# EAGLE schematic rwr_schematic (EAGLE 7.4.0)

## Sheet 1 of 8: Microcontroller Circuitry
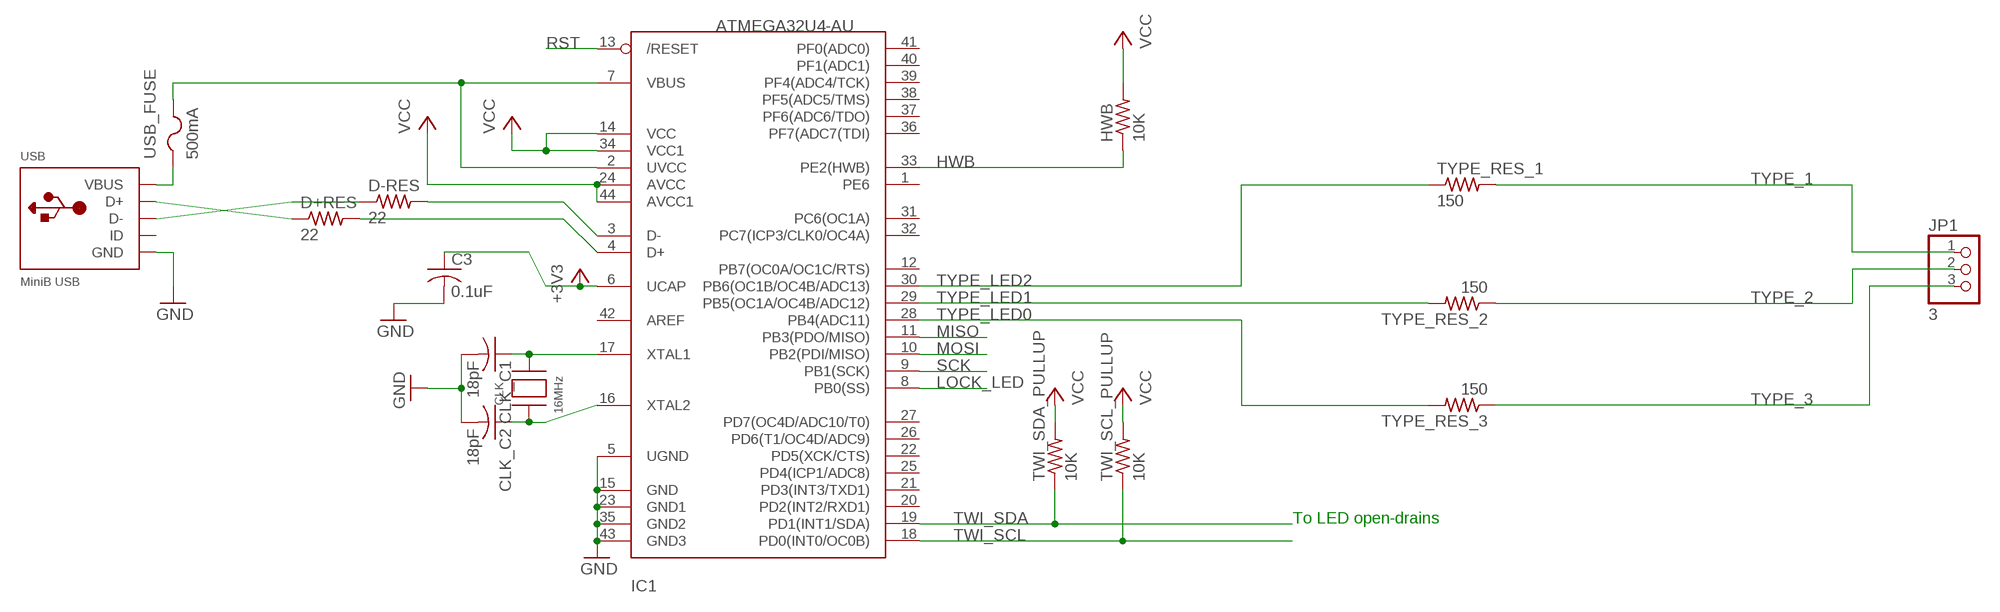
[diagram p0: schematic, sheet 1]

### Parts
C3  0.1uF  C-USC0805K  [C0805K]
CLK  16MHz  XTALNX5032  [NX5032]
CLK_C1  18pF  C-USC0805K  [C0805K]
CLK_C2  18pF  C-USC0805K  [C0805K]
D+RES  22  R-US_R0805  [R0805]
D-RES  22  R-US_R0805  [R0805]
HWB  10K  R-US_R0805  [R0805]
IC1  ATMEGA32U4-AU  [TQFP44]
JP1  3  PINHD-1X3  [1X03]
TWI_SCL_PULLUP  10K  R-US_R0805  [R0805]
TWI_SDA_PULLUP  10K  R-US_R0805  [R0805]
TYPE_RES_1  150  R-US_R0805  [R0805]
TYPE_RES_2  150  R-US_R0805  [R0805]
TYPE_RES_3  150  R-US_R0805  [R0805]
USB  MiniB USB  USBMINIB  [USB-MINIB]
USB_FUSE  500mA  PTCFUSE-1206  [R1206]

### Nets
+3V3: C3.1 IC1.6(UCAP)
GND: C3.2 CLK_C1.2 CLK_C2.2 IC1.5(UGND) IC1.15(GND) IC1.23(GND1) IC1.35(GND2) IC1.43(GND3) USB.GND ; also sheet 2,3,4,5,6,7,8
HWB: HWB.1 IC1.33(PE2(HWB))
LOCK_LED: IC1.8(PB0(SS)) ; also sheet 8
MISO: IC1.11(PB3(PDO/MISO)) ; also sheet 3
MOSI: IC1.10(PB2(PDI/MISO)) ; also sheet 3
N$10: IC1.2(UVCC) IC1.7(VBUS) USB_FUSE.2
N$61: D-RES.2 IC1.3(D-)
N$62: D+RES.2 IC1.4(D+)
N$63: CLK.P$1 CLK_C2.1 IC1.16(XTAL2)
N$64: CLK.P$2 CLK_C1.1 IC1.17(XTAL1)
N$67: D+RES.1 USB.D+
N$68: D-RES.1 USB.D-
RST: IC1.13(/RESET) ; also sheet 3
SCK: IC1.9(PB1(SCK)) ; also sheet 3
TWI_SCL: IC1.18(PD0(INT0/OC0B)) TWI_SCL_PULLUP.1 ; also sheet 4,5,6,7
TWI_SDA: IC1.19(PD1(INT1/SDA)) TWI_SDA_PULLUP.1 ; also sheet 4,5,6,7
TYPE_1: JP1.1 TYPE_RES_1.2
TYPE_2: JP1.2 TYPE_RES_2.1
TYPE_3: JP1.3 TYPE_RES_3.1
TYPE_LED0: IC1.28(PB4(ADC11)) TYPE_RES_3.2
TYPE_LED1: IC1.29(PB5(OC1A/OC4B/ADC12)) TYPE_RES_2.2
TYPE_LED2: IC1.30(PB6(OC1B/OC4B/ADC13)) TYPE_RES_1.1
VBUS: USB.VBUS USB_FUSE.1
VCC [Power]: HWB.2 IC1.14(VCC) IC1.24(AVCC) IC1.34(VCC1) IC1.44(AVCC1) TWI_SCL_PULLUP.2 TWI_SDA_PULLUP.2 ; also sheet 2,3,4,5,6,7,8
Unconnected: IC1.1(PE6) IC1.12(PB7(OC0A/OC1C/RTS)) IC1.20(PD2(INT2/RXD1)) IC1.21(PD3(INT3/TXD1)) IC1.22(PD5(XCK/CTS)) IC1.25(PD4(ICP1/ADC8)) IC1.26(PD6(T1/OC4D/ADC9)) IC1.27(PD7(OC4D/ADC10/T0)) IC1.31(PC6(OC1A)) IC1.32(PC7(ICP3/CLK0/OC4A)) IC1.36(PF7(ADC7(TDI)) IC1.37(PF6(ADC6/TDO)) IC1.38(PF5(ADC5/TMS)) IC1.39(PF4(ADC4/TCK)) IC1.40(PF1(ADC1)) IC1.41(PF0(ADC0)) IC1.42(AREF) USB.ID

### Notes on the sheet
- To LED open-drains

## Sheet 2 of 8: Power Circuitry
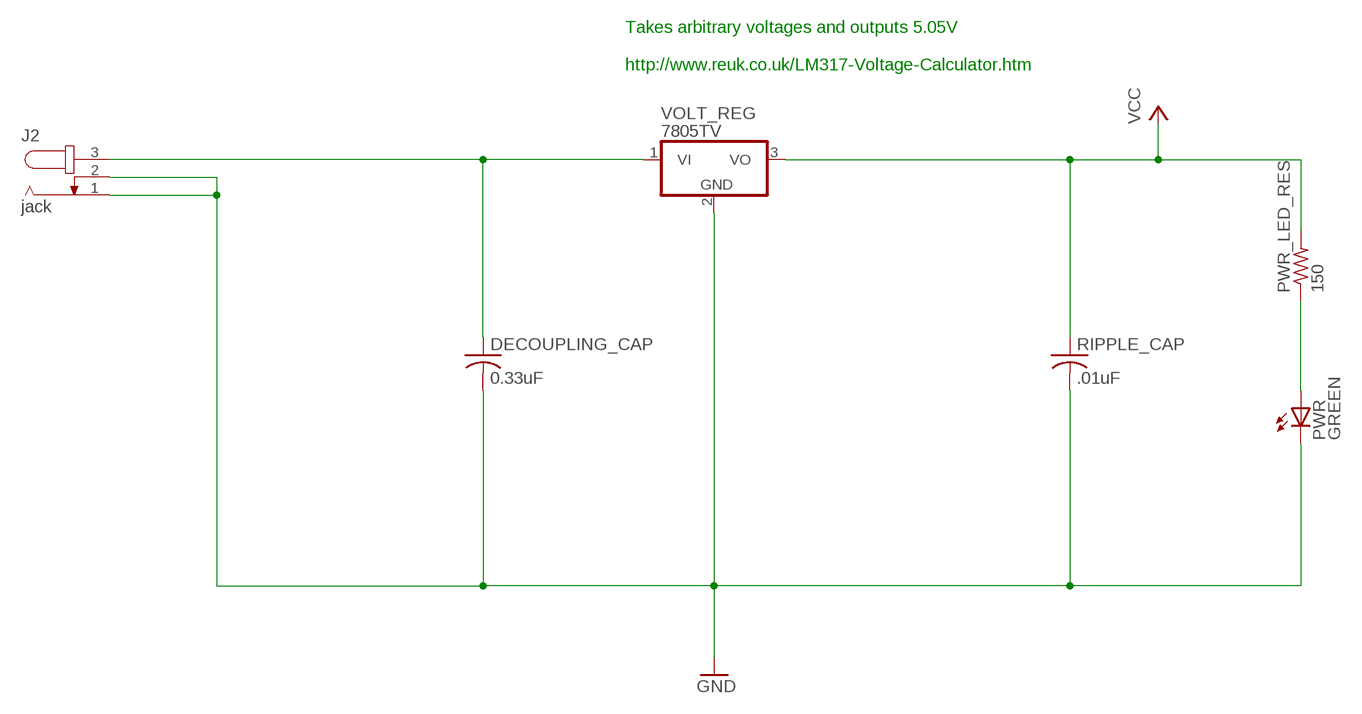
[diagram p1: schematic, sheet 2]

### Parts
DECOUPLING_CAP  0.33uF  C-USC0805K  [C0805K]
J2  jack  JACK-PLUG0  [SPC4077]
PWR  GREEN  LEDCHIPLED_0805  [CHIPLED_0805]
PWR_LED_RES  150  R-US_R0805  [R0805]
RIPPLE_CAP  .01uF  C-USC0805K  [C0805K]
VOLT_REG  7805TV  [TO220V]

### Nets
GND: DECOUPLING_CAP.2 J2.1 J2.2 PWR.C RIPPLE_CAP.2 VOLT_REG.2(GND) ; also sheet 1,3,4,5,6,7,8
JACK_VCC [big_power]: DECOUPLING_CAP.1 J2.3 VOLT_REG.1(VI)
N$44: PWR.A PWR_LED_RES.1
VCC [Power]: PWR_LED_RES.2 RIPPLE_CAP.1 VOLT_REG.3(VO) ; also sheet 1,3,4,5,6,7,8

### Notes on the sheet
- Takes arbitrary voltages and outputs 5.05V
  
  http://www.reuk.co.uk/LM317-Voltage-Calculator.htm

## Sheet 3 of 8: ISP Programmer
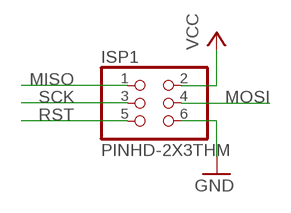
[diagram p2: schematic, sheet 3]

### Parts
ISP1  PINHD-2X3THM  [ISP6]

### Nets
GND: ISP1.6 ; also sheet 1,2,4,5,6,7,8
MISO: ISP1.1 ; also sheet 1
MOSI: ISP1.4 ; also sheet 1
RST: ISP1.5 ; also sheet 1
SCK: ISP1.3 ; also sheet 1
VCC [Power]: ISP1.2 ; also sheet 1,2,4,5,6,7,8

## Sheet 4 of 8: Signal Strength LEDs
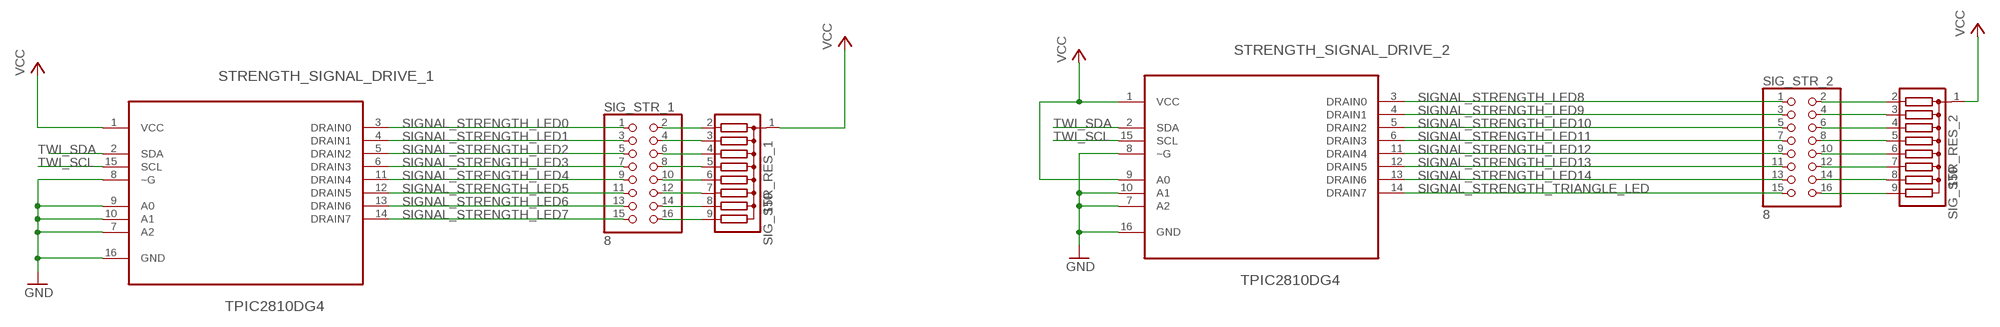
[diagram p3: schematic, sheet 4]

### Parts
SIG_STR_1  8  PINHD-2X8  [2X08]
SIG_STR_2  8  PINHD-2X8  [2X08]
SIG_STR_RES_1  150  G08R  [SIL9]
SIG_STR_RES_2  150  G08R  [SIL9]
STRENGTH_SIGNAL_DRIVE_1  TPIC2810DG4  [SOIC127P600X175-16N]
STRENGTH_SIGNAL_DRIVE_2  TPIC2810DG4  [SOIC127P600X175-16N]

### Nets
GND: STRENGTH_SIGNAL_DRIVE_1.7(A2) STRENGTH_SIGNAL_DRIVE_1.8(~G) STRENGTH_SIGNAL_DRIVE_1.9(A0) STRENGTH_SIGNAL_DRIVE_1.10(A1) STRENGTH_SIGNAL_DRIVE_1.16(GND) STRENGTH_SIGNAL_DRIVE_2.7(A2) STRENGTH_SIGNAL_DRIVE_2.8(~G) STRENGTH_SIGNAL_DRIVE_2.10(A1) STRENGTH_SIGNAL_DRIVE_2.16(GND) ; also sheet 1,2,3,5,6,7,8
N$1: SIG_STR_2.16 SIG_STR_RES_2.9
N$2: SIG_STR_2.14 SIG_STR_RES_2.8
N$3: SIG_STR_2.12 SIG_STR_RES_2.7
N$4: SIG_STR_2.10 SIG_STR_RES_2.6
N$5: SIG_STR_2.8 SIG_STR_RES_2.5
N$6: SIG_STR_2.6 SIG_STR_RES_2.4
N$7: SIG_STR_2.4 SIG_STR_RES_2.3
N$8: SIG_STR_2.2 SIG_STR_RES_2.2
N$9: SIG_STR_1.16 SIG_STR_RES_1.9
N$11: SIG_STR_1.14 SIG_STR_RES_1.8
N$12: SIG_STR_1.12 SIG_STR_RES_1.7
N$18: SIG_STR_1.10 SIG_STR_RES_1.6
N$20: SIG_STR_1.8 SIG_STR_RES_1.5
N$22: SIG_STR_1.6 SIG_STR_RES_1.4
N$23: SIG_STR_1.4 SIG_STR_RES_1.3
N$24: SIG_STR_1.2 SIG_STR_RES_1.2
SIGNAL_STRENGTH_LED0: SIG_STR_1.1 STRENGTH_SIGNAL_DRIVE_1.3(DRAIN0)
SIGNAL_STRENGTH_LED1: SIG_STR_1.3 STRENGTH_SIGNAL_DRIVE_1.4(DRAIN1)
SIGNAL_STRENGTH_LED2: SIG_STR_1.5 STRENGTH_SIGNAL_DRIVE_1.5(DRAIN2)
SIGNAL_STRENGTH_LED3: SIG_STR_1.7 STRENGTH_SIGNAL_DRIVE_1.6(DRAIN3)
SIGNAL_STRENGTH_LED4: SIG_STR_1.9 STRENGTH_SIGNAL_DRIVE_1.11(DRAIN4)
SIGNAL_STRENGTH_LED5: SIG_STR_1.11 STRENGTH_SIGNAL_DRIVE_1.12(DRAIN5)
SIGNAL_STRENGTH_LED6: SIG_STR_1.13 STRENGTH_SIGNAL_DRIVE_1.13(DRAIN6)
SIGNAL_STRENGTH_LED7: SIG_STR_1.15 STRENGTH_SIGNAL_DRIVE_1.14(DRAIN7)
SIGNAL_STRENGTH_LED8: SIG_STR_2.1 STRENGTH_SIGNAL_DRIVE_2.3(DRAIN0)
SIGNAL_STRENGTH_LED9: SIG_STR_2.3 STRENGTH_SIGNAL_DRIVE_2.4(DRAIN1)
SIGNAL_STRENGTH_LED10: SIG_STR_2.5 STRENGTH_SIGNAL_DRIVE_2.5(DRAIN2)
SIGNAL_STRENGTH_LED11: SIG_STR_2.7 STRENGTH_SIGNAL_DRIVE_2.6(DRAIN3)
SIGNAL_STRENGTH_LED12: SIG_STR_2.9 STRENGTH_SIGNAL_DRIVE_2.11(DRAIN4)
SIGNAL_STRENGTH_LED13: SIG_STR_2.11 STRENGTH_SIGNAL_DRIVE_2.12(DRAIN5)
SIGNAL_STRENGTH_LED14: SIG_STR_2.13 STRENGTH_SIGNAL_DRIVE_2.13(DRAIN6)
SIGNAL_STRENGTH_TRIANGLE_LED: SIG_STR_2.15 STRENGTH_SIGNAL_DRIVE_2.14(DRAIN7)
TWI_SCL: STRENGTH_SIGNAL_DRIVE_1.15(SCL) STRENGTH_SIGNAL_DRIVE_2.15(SCL) ; also sheet 1,5,6,7
TWI_SDA: STRENGTH_SIGNAL_DRIVE_1.2(SDA) STRENGTH_SIGNAL_DRIVE_2.2(SDA) ; also sheet 1,5,6,7
VCC [Power]: SIG_STR_RES_1.1 SIG_STR_RES_2.1 STRENGTH_SIGNAL_DRIVE_1.1(VCC) STRENGTH_SIGNAL_DRIVE_2.1(VCC) STRENGTH_SIGNAL_DRIVE_2.9(A0) ; also sheet 1,2,3,5,6,7,8

## Sheet 5 of 8: Main target directional LEDs
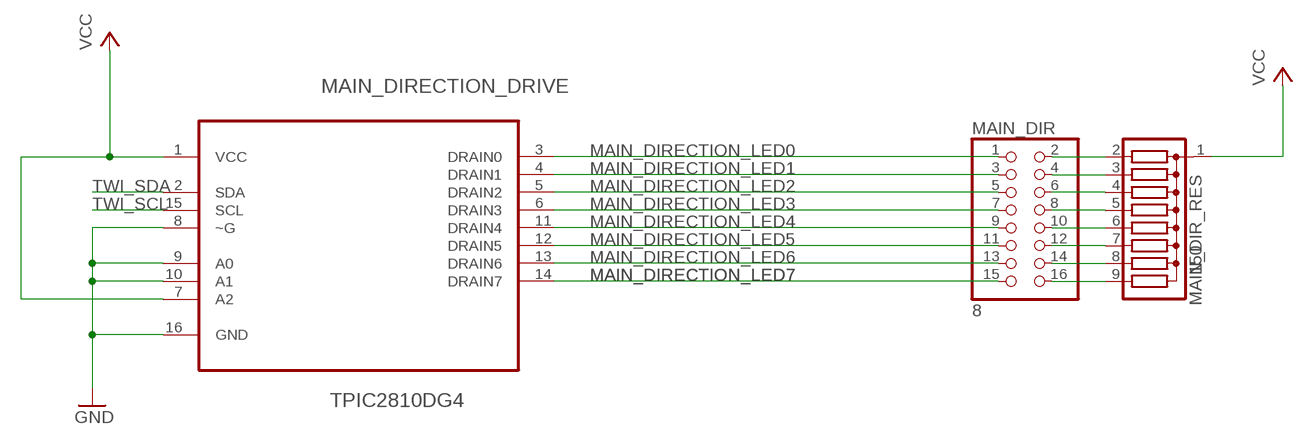
[diagram p4: schematic, sheet 5]

### Parts
MAIN_DIR  8  PINHD-2X8  [2X08]
MAIN_DIR_RES  150  G08R  [SIL9]
MAIN_DIRECTION_DRIVE  TPIC2810DG4  [SOIC127P600X175-16N]

### Nets
GND: MAIN_DIRECTION_DRIVE.8(~G) MAIN_DIRECTION_DRIVE.9(A0) MAIN_DIRECTION_DRIVE.10(A1) MAIN_DIRECTION_DRIVE.16(GND) ; also sheet 1,2,3,4,6,7,8
MAIN_DIRECTION_LED0: MAIN_DIR.1 MAIN_DIRECTION_DRIVE.3(DRAIN0)
MAIN_DIRECTION_LED1: MAIN_DIR.3 MAIN_DIRECTION_DRIVE.4(DRAIN1)
MAIN_DIRECTION_LED2: MAIN_DIR.5 MAIN_DIRECTION_DRIVE.5(DRAIN2)
MAIN_DIRECTION_LED3: MAIN_DIR.7 MAIN_DIRECTION_DRIVE.6(DRAIN3)
MAIN_DIRECTION_LED4: MAIN_DIR.9 MAIN_DIRECTION_DRIVE.11(DRAIN4)
MAIN_DIRECTION_LED5: MAIN_DIR.11 MAIN_DIRECTION_DRIVE.12(DRAIN5)
MAIN_DIRECTION_LED6: MAIN_DIR.13 MAIN_DIRECTION_DRIVE.13(DRAIN6)
MAIN_DIRECTION_LED7: MAIN_DIR.15 MAIN_DIRECTION_DRIVE.14(DRAIN7)
N$14: MAIN_DIR.2 MAIN_DIR_RES.2
N$26: MAIN_DIR.16 MAIN_DIR_RES.9
N$28: MAIN_DIR.14 MAIN_DIR_RES.8
N$29: MAIN_DIR.12 MAIN_DIR_RES.7
N$30: MAIN_DIR.10 MAIN_DIR_RES.6
N$31: MAIN_DIR.8 MAIN_DIR_RES.5
N$32: MAIN_DIR.4 MAIN_DIR_RES.3
N$33: MAIN_DIR.6 MAIN_DIR_RES.4
TWI_SCL: MAIN_DIRECTION_DRIVE.15(SCL) ; also sheet 1,4,6,7
TWI_SDA: MAIN_DIRECTION_DRIVE.2(SDA) ; also sheet 1,4,6,7
VCC [Power]: MAIN_DIR_RES.1 MAIN_DIRECTION_DRIVE.1(VCC) MAIN_DIRECTION_DRIVE.7(A2) ; also sheet 1,2,3,4,6,7,8

## Sheet 6 of 8: Other target directional LEDs
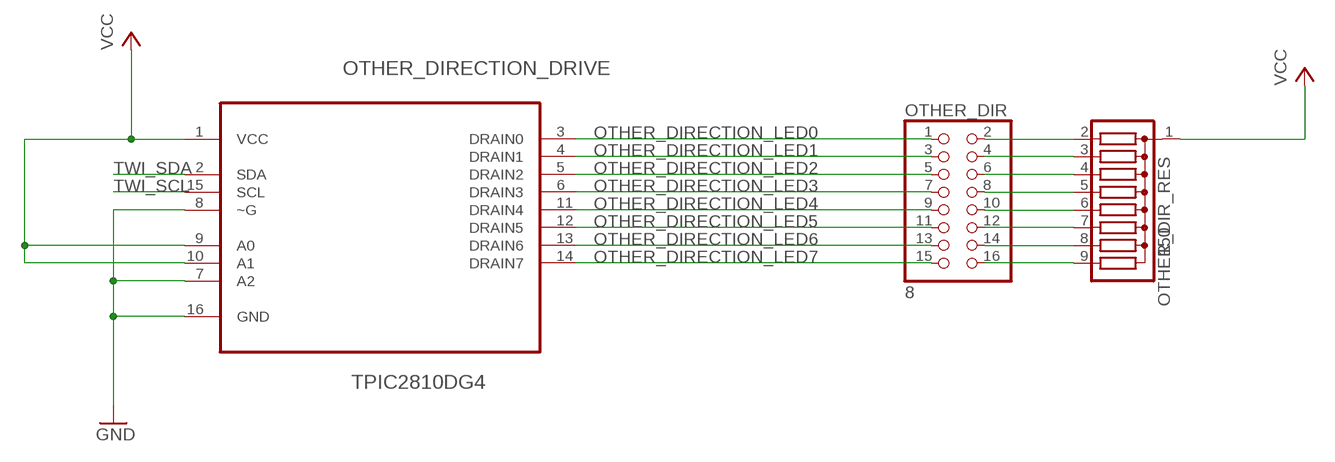
[diagram p5: schematic, sheet 6]

### Parts
OTHER_DIR  8  PINHD-2X8  [2X08]
OTHER_DIR_RES  150  G08R  [SIL9]
OTHER_DIRECTION_DRIVE  TPIC2810DG4  [SOIC127P600X175-16N]

### Nets
GND: OTHER_DIRECTION_DRIVE.7(A2) OTHER_DIRECTION_DRIVE.8(~G) OTHER_DIRECTION_DRIVE.16(GND) ; also sheet 1,2,3,4,5,7,8
N$13: OTHER_DIR.2 OTHER_DIR_RES.2
N$34: OTHER_DIR.4 OTHER_DIR_RES.3
N$35: OTHER_DIR.8 OTHER_DIR_RES.5
N$36: OTHER_DIR.6 OTHER_DIR_RES.4
N$37: OTHER_DIR.10 OTHER_DIR_RES.6
N$38: OTHER_DIR.12 OTHER_DIR_RES.7
N$39: OTHER_DIR.14 OTHER_DIR_RES.8
N$40: OTHER_DIR.16 OTHER_DIR_RES.9
OTHER_DIRECTION_LED0: OTHER_DIR.1 OTHER_DIRECTION_DRIVE.3(DRAIN0)
OTHER_DIRECTION_LED1: OTHER_DIR.3 OTHER_DIRECTION_DRIVE.4(DRAIN1)
OTHER_DIRECTION_LED2: OTHER_DIR.5 OTHER_DIRECTION_DRIVE.5(DRAIN2)
OTHER_DIRECTION_LED3: OTHER_DIR.7 OTHER_DIRECTION_DRIVE.6(DRAIN3)
OTHER_DIRECTION_LED4: OTHER_DIR.9 OTHER_DIRECTION_DRIVE.11(DRAIN4)
OTHER_DIRECTION_LED5: OTHER_DIR.11 OTHER_DIRECTION_DRIVE.12(DRAIN5)
OTHER_DIRECTION_LED6: OTHER_DIR.13 OTHER_DIRECTION_DRIVE.13(DRAIN6)
OTHER_DIRECTION_LED7: OTHER_DIR.15 OTHER_DIRECTION_DRIVE.14(DRAIN7)
TWI_SCL: OTHER_DIRECTION_DRIVE.15(SCL) ; also sheet 1,4,5,7
TWI_SDA: OTHER_DIRECTION_DRIVE.2(SDA) ; also sheet 1,4,5,7
VCC [Power]: OTHER_DIR_RES.1 OTHER_DIRECTION_DRIVE.1(VCC) OTHER_DIRECTION_DRIVE.9(A0) OTHER_DIRECTION_DRIVE.10(A1) ; also sheet 1,2,3,4,5,7,8

## Sheet 7 of 8: Misc LEDs
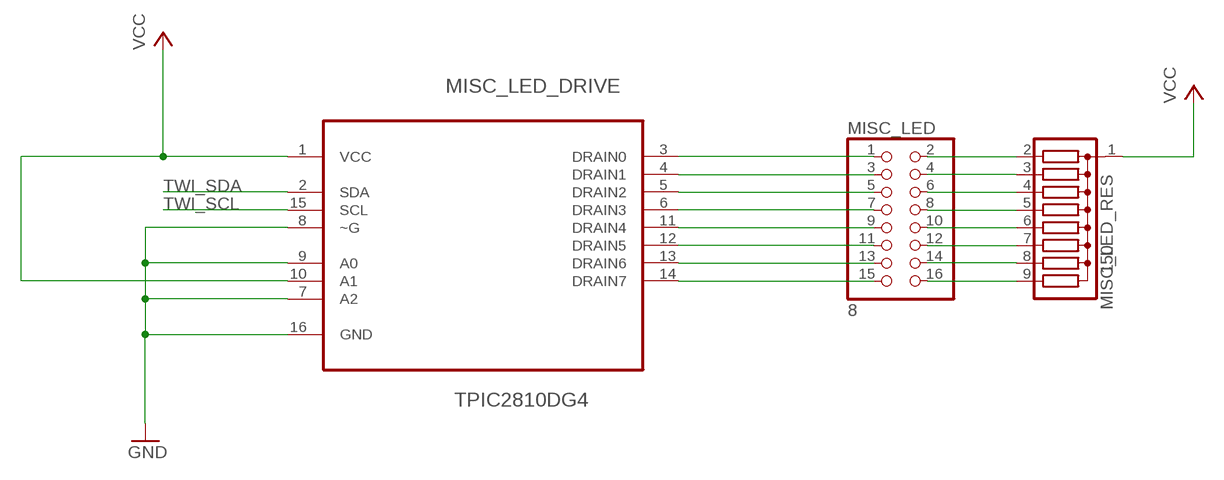
[diagram p6: schematic, sheet 7]

### Parts
MISC_LED  8  PINHD-2X8  [2X08]
MISC_LED_DRIVE  TPIC2810DG4  [SOIC127P600X175-16N]
MISC_LED_RES  150  G08R  [SIL9]

### Nets
GND: MISC_LED_DRIVE.7(A2) MISC_LED_DRIVE.8(~G) MISC_LED_DRIVE.9(A0) MISC_LED_DRIVE.16(GND) ; also sheet 1,2,3,4,5,6,8
N$16: MISC_LED.15 MISC_LED_DRIVE.14(DRAIN7)
N$17: MISC_LED.13 MISC_LED_DRIVE.13(DRAIN6)
N$19: MISC_LED.11 MISC_LED_DRIVE.12(DRAIN5)
N$21: MISC_LED.9 MISC_LED_DRIVE.11(DRAIN4)
N$25: MISC_LED.7 MISC_LED_DRIVE.6(DRAIN3)
N$41: MISC_LED.2 MISC_LED_RES.2
N$42: MISC_LED.4 MISC_LED_RES.3
N$43: MISC_LED.6 MISC_LED_RES.4
N$45: MISC_LED.8 MISC_LED_RES.5
N$47: MISC_LED.10 MISC_LED_RES.6
N$48: MISC_LED.12 MISC_LED_RES.7
N$49: MISC_LED.14 MISC_LED_RES.8
N$50: MISC_LED.16 MISC_LED_RES.9
N$51: MISC_LED.5 MISC_LED_DRIVE.5(DRAIN2)
N$52: MISC_LED.3 MISC_LED_DRIVE.4(DRAIN1)
N$53: MISC_LED.1 MISC_LED_DRIVE.3(DRAIN0)
TWI_SCL: MISC_LED_DRIVE.15(SCL) ; also sheet 1,4,5,6
TWI_SDA: MISC_LED_DRIVE.2(SDA) ; also sheet 1,4,5,6
VCC [Power]: MISC_LED_DRIVE.1(VCC) MISC_LED_DRIVE.10(A1) MISC_LED_RES.1 ; also sheet 1,2,3,4,5,6,8

## Sheet 8 of 8: Lock LEDs
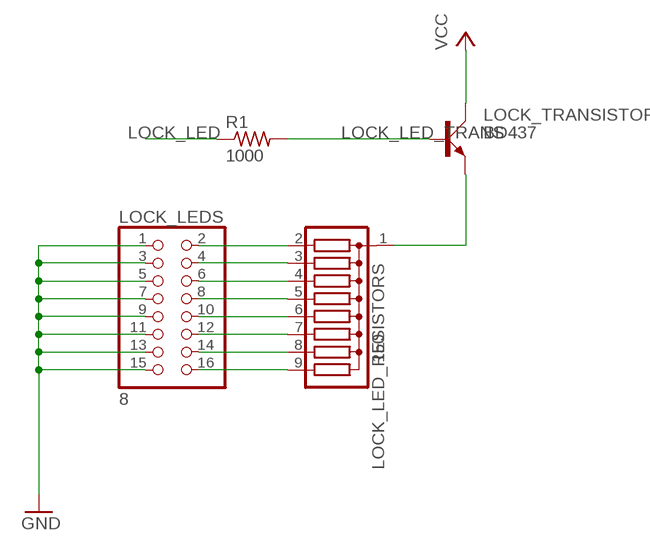
[diagram p7: schematic, sheet 8]

### Parts
LOCK_LED_RESISTORS  150  G08R  [SIL9]
LOCK_LEDS  8  PINHD-2X8  [2X08]
LOCK_TRANSISTOR  BD437  [TO126AV]
R1  1000  R-US_R0805  [R0805]

### Nets
GND: LOCK_LEDS.1 LOCK_LEDS.3 LOCK_LEDS.5 LOCK_LEDS.7 LOCK_LEDS.9 LOCK_LEDS.11 LOCK_LEDS.13 LOCK_LEDS.15 ; also sheet 1,2,3,4,5,6,7
LOCK_LED: R1.1 ; also sheet 1
LOCK_LED_TRANS: LOCK_TRANSISTOR.B R1.2
LOCK_TRANSISTOR: LOCK_LED_RESISTORS.1 LOCK_TRANSISTOR.E
N$15: LOCK_LED_RESISTORS.2 LOCK_LEDS.2
N$27: LOCK_LED_RESISTORS.3 LOCK_LEDS.4
N$46: LOCK_LED_RESISTORS.4 LOCK_LEDS.6
N$54: LOCK_LED_RESISTORS.5 LOCK_LEDS.8
N$55: LOCK_LED_RESISTORS.6 LOCK_LEDS.10
N$56: LOCK_LED_RESISTORS.7 LOCK_LEDS.12
N$57: LOCK_LED_RESISTORS.8 LOCK_LEDS.14
N$58: LOCK_LED_RESISTORS.9 LOCK_LEDS.16
VCC [Power]: LOCK_TRANSISTOR.C ; also sheet 1,2,3,4,5,6,7

## Library data of the parts
C3 CLK_C1 CLK_C2 DECOUPLING_CAP RIPPLE_CAP = adafruit:C-US: CAPACITOR, American symbol
CLK = adaprog:XTAL
D+RES D-RES HWB PWR_LED_RES TWI_SCL_PULLUP TWI_SDA_PULLUP = adafruit:R-US_: RESISTOR, American symbol
IC1 = adaprog:ATMEGA32U4
ISP1 = adaprog:PINHD-2X3
J2 = con-jack:JACK-PLUG: DC POWER JACK Power Jack, DC, Right Angle, Through Hole, Rated 5A at 16VDC, PC Terminals Distributor: Farnell (www.Farnell.de) Drawing: 84N1161.pdf / 84N1162.pdf Manufacturer: SPC Technology (www.spctechnology.com) Type: SPC4077 / SPC 4078; OC_FARNELL: unknown; OC_NEWARK: unknown
JP1 = pinhead:PINHD-1X3: PIN HEADER
LOCK_LED_RESISTORS MAIN_DIR_RES MISC_LED_RES OTHER_DIR_RES SIG_STR_RES_1 SIG_STR_RES_2 = resistor-sil:G08R: SIL RESISTOR; OC_FARNELL: unknown; OC_NEWARK: unknown
LOCK_LEDS MAIN_DIR MISC_LED OTHER_DIR SIG_STR_1 SIG_STR_2 = pinhead:PINHD-2X8: PIN HEADER
LOCK_TRANSISTOR = transistor-power:BD437: NPN TRANSISTOR
MAIN_DIRECTION_DRIVE MISC_LED_DRIVE OTHER_DIRECTION_DRIVE STRENGTH_SIGNAL_DRIVE_1 STRENGTH_SIGNAL_DRIVE_2 = ti_led_driver:TPIC2810DG4: 8-BIT LED DRIVER WITH I2C INTERFACE; MPN: TPIC2810DG4; OC_FARNELL: -; OC_NEWARK: 02M4281; PACKAGE: SOIC-16; SUPPLIER: TEXAS INSTRUMENTS
PWR = adafruit:LED: LED OSRAM: - CHIPLED LG R971, LG N971, LY N971, LG Q971, LY Q971, LO R971, LY R971 LH N974, LH R974 LS Q976, LO Q976, LY Q976 LO Q996 - Hyper CHIPLED LW Q18S LB Q993, LB Q99A, LB R99A - SideLED LS A670, LO A670, LY A670, LG A670, LP A670 LB A673, LV A673, LT A673, LW A673 LH A674 LY A675 LS A676, LA A676, LO A676, LY A676, LW A676 LS A679, LY A679, LG A679 - Hyper Micro SIDELED® LS Y876, LA Y876, LO Y876, LY Y876 LT Y87S - SmartLED LW L88C, LW L88S LB L89C, LB L89S, LG L890 LS L89K, LO L89K, LY L89K LS L896, LA L896, LO L896, LY L896 - TOPLED LS T670, LO T670, LY T670, LG T670, LP T670 LSG T670, LSP T670, LSY T670, LOP T670, LYG T670 LG T671, LOG T671, LSG T671 LB T673, LV T673, LT T673, LW T673 LH T674 LS T676, LA T676, LO T676, LY T676, LB T676, LH T676, LSB T676, LW T676 LB T67C, LV T67C, LT T67C, LS T67K, LO T67K, LY T67K, LW E67C LS E67B, LA E67B, LO E67B, LY E67B, LB E67C, LV E67C, LT E67C LW T67C LS T679, LY T679, LG T679 LS T770, LO T770, LY T770, LG T770, LP T770 LB T773, LV T773, LT T773, LW T773 LH T774 LS E675, LA E675, LY E675, LS T675 LS T776, LA T776, LO T776, LY T776, LB T776 LHGB T686 LT T68C, LB T68C - Hyper Mini TOPLED® LB M676 - Mini TOPLED Santana® LG M470 LS M47K, LO M47K, LY M47K Source: http://www.osram.convergy.de/
R1 = rcl:R-US_: RESISTOR, American symbol
TYPE_RES_1-TYPE_RES_3 = resistor:R-US_: RESISTOR, American symbol; OC_NEWARK: unknown
USB = adafruit:USB: USB Connectors USBMINIB - Surface Mount Female Mini-B USB Connector 4UConnector: 06564 By microbuilder.eu Thru-hole RA Female Mini-B USB Connector 4UConnector: 18732 By ladyada.net
USB_FUSE = adafruit:PTCFUSE: PTC fuses, resettable thermistors
VOLT_REG = linear:78*: Positive VOLTAGE REGULATOR Source: http://cache.national.com/ds/LM/LM78L05.pdf http://www.fairchildsemi.com/ds/LM/LM7805.pdf

## Net classes
0 default: width 0.152 mm
1 Power: width 0.406 mm
2 big_power: width 0.508 mm